# Altium schematic sheet DevKitWRM1470-r1.0.SchDoc
size A3; SheetNumber: 1; PageSetup: Record=PageOptions|CenterHorizontal=True|CenterVertical=True|PrintScale=0.52|XCorrection=1.00|YCorrection=1.00|PrintKind=1|BorderSize=5000000|LeftOffset=0|BottomOffset=0|Orientation=2|PaperLength=1000|PaperWidth=1000|Scale=100|PaperSource=7|PrintQuality=600|MediaType=1|DitherType=10|PaperKind=A4|PrintScaleMode=1
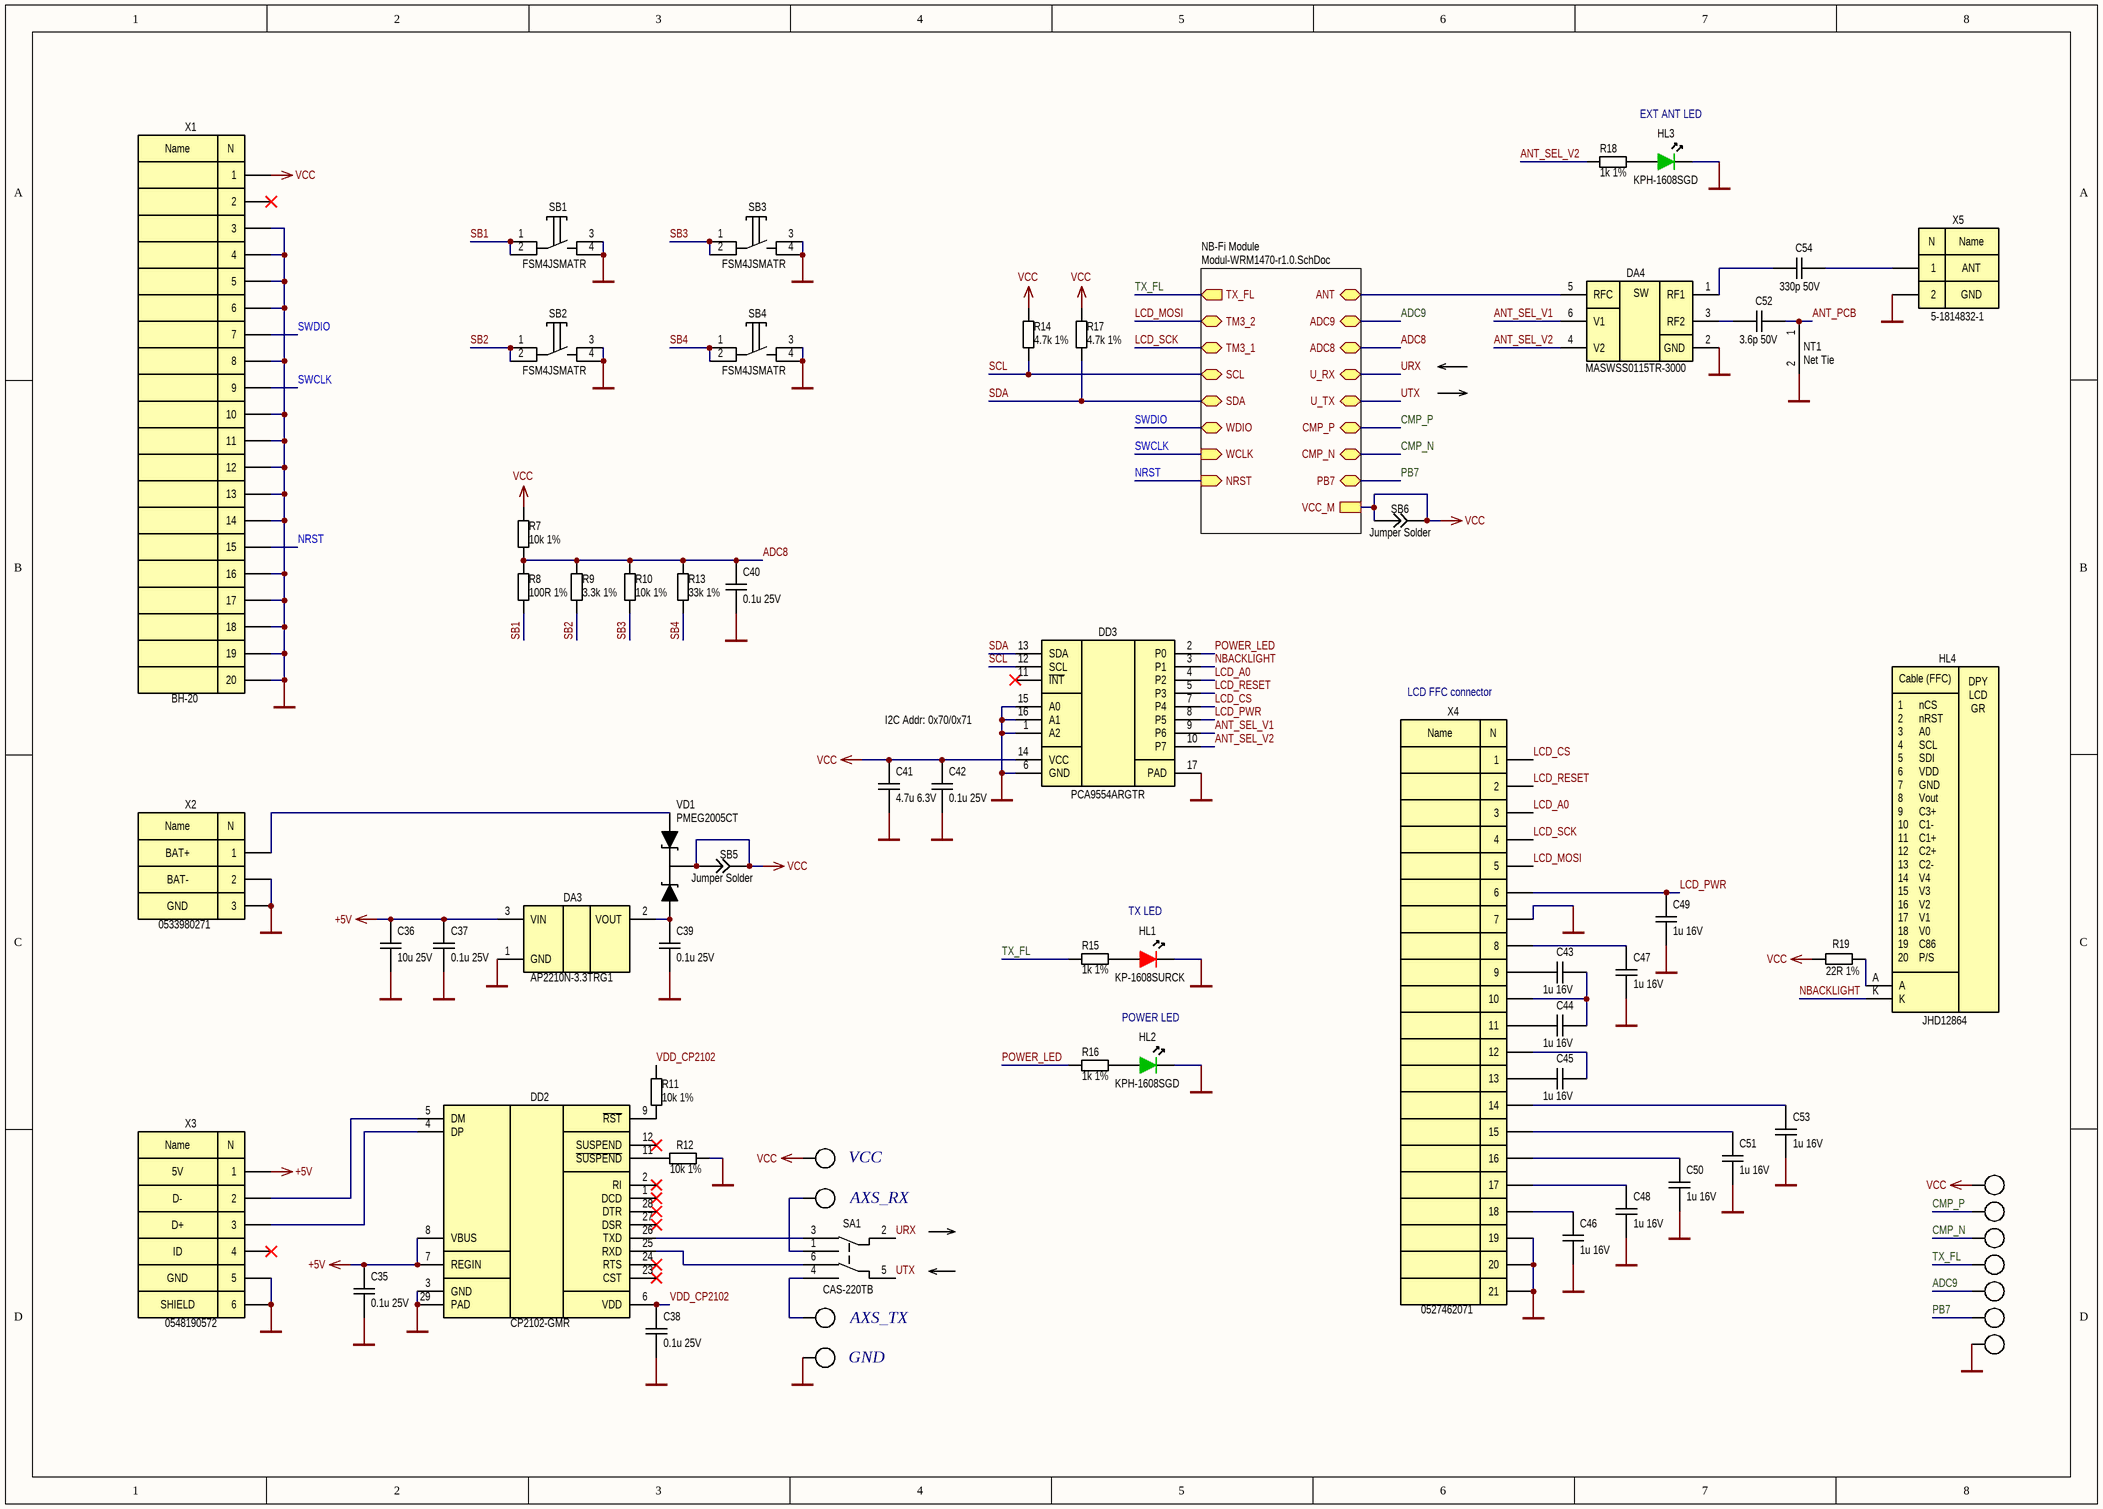
[diagram p0: DevKitWRM1470-r1.0.SchDoc]

## Parts
C35  0.1u 25V  [C0402]
C36  10u 25V  [C0805]
C37  0.1u 25V  [C0402]
C38  0.1u 25V  [C0402]
C39  0.1u 25V  [C0402]
C40  0.1u 25V  [C0402]
C41  4.7u 6.3V  [C0402]
C42  0.1u 25V  [C0402]
C43  1u 16V  [C0402]
C44  1u 16V  [C0402]
C45  1u 16V  [C0402]
C46  1u 16V  [C0402]
C47  1u 16V  [C0402]
C48  1u 16V  [C0402]
C49  1u 16V  [C0402]
C50  1u 16V  [C0402]
C51  1u 16V  [C0402]
C52  3.6p 50V  [C0402]
C53  1u 16V  [C0402]
C54  330p 50V  [C0402]
DA3  AP2210N-3.3TRG1  [SOT23-3L]
DA4  MASWSS0115TR-3000  [SOT323-6]
DD2  CP2102-GMR  [QFN28]
DD3  PCA9554ARGTR  [QFN16]
HL1  KP-1608SURCK  [LED0603_RED]
HL2  KPH-1608SGD  [LED0603_GREEN]
HL3  KPH-1608SGD  [LED0603_GREEN]
HL4  JHD12864  [JHD12864]
NT1  Net Tie  [NETTIE-5.0x4.0]  (net tie, no BOM)
R7  10k 1%  [R0402]
R8  100R 1%  [R0402]
R9  3.3k 1%  [R0402]
R10  10k 1%  [R0402]
R11  10k 1%  [R0402]
R12  10k 1%  [R0402]
R13  33k 1%  [R0402]
R14  4.7k 1%  [R0402]
R15  1k 1%  [R0402]
R16  1k 1%  [R0402]
R17  4.7k 1%  [R0402]
R18  1k 1%  [R0402]
R19  22R 1%  [R0402]
SA1  CAS-220TB  [CAS-220]
SB1  FSM4JSMATR  [FSM4JSMATR]
SB2  FSM4JSMATR  [FSM4JSMATR]
SB3  FSM4JSMATR  [FSM4JSMATR]
SB4  FSM4JSMATR  [FSM4JSMATR]
SB5  Jumper Solder  [SB0805]  (no BOM)
SB6  Jumper Solder  [SB0805]  (no BOM)
VD1  PMEG2005CT  [SOT23-3L]
X1  BH-20  [BH-20_PCB]
X2  0533980271  [0533980271_PCB]
X3  0548190572  [0548190572]
X4  0527462071  [0527462071_PCB]
X5  5-1814832-1  [5-1814832-1]
XP1  PLS-1  [HDR1X1]  (value not drawn)
XP2  PLS-1  [HDR1X1]  (value not drawn)
XP3  PLS-1  [HDR1X1]  (value not drawn)
XP4  PLS-1  [HDR1X1]  (value not drawn)
XP5  PLS-1  [HDR1X1]  (value not drawn)
XP6  PLS-1  [HDR1X1]  (value not drawn)
XP7  PLS-1  [HDR1X1]  (value not drawn)
XP8  PLS-1  [HDR1X1]  (value not drawn)
XP9  PLS-1  [HDR1X1]  (value not drawn)
XP10  PLS-1  [HDR1X1]  (value not drawn)
XP11  PLS-1  [HDR1X1]  (value not drawn)

## Sub-sheets
NB-Fi Module = Modul-WRM1470-r1.0.SchDoc: ADC8 (bidir), TM3_2 (bidir), ADC9 (bidir), TM3_1 (bidir), SCL (bidir), SDA (bidir), WDIO (bidir), WCLK (in), NRST (in), U_RX (bidir), U_TX (bidir), CMP_P (bidir), CMP_N (bidir), ANT (bidir), TX_FL (out), PB7 (bidir), VCC_M

## Nets
+5V: C35.2 C36.1 C37.2 DA3.3(VIN) DD2.7(REGIN) DD2.8(VBUS) X3.1
GND: C35.1 C36.2 C37.1 C38.1 C39.1 C40.1 C41.1 C42.1 C46.1 C47.1 C48.1 C49.1 C50.1 C51.1 C53.1 DA3.1(GND) DA4.2(GND) DD2.3(GND) DD2.29(PAD) DD3.1(A2) DD3.6(GND) DD3.15(A0) DD3.16(A1) DD3.17(PAD) HL1.2 HL2.2 HL3.2 NT1.2 R12.1 SB1.3 SB1.4 SB2.3 SB2.4 SB3.3 SB3.4 SB4.3 SB4.4 X1.3 X1.4 X1.5 X1.6 X1.8 X1.10 X1.11 X1.12 X1.13 X1.14 X1.16 X1.17 X1.18 X1.19 X1.20 X2.2 X2.3 X3.5 X3.6 X4.7 X4.19 X4.20 X4.21 X5.2 XP2.1 XP11.1
VCC: C41.2 C42.2 DD3.14(VCC) R7.2 R14.2 R17.2 R19.2 SB5.1 SB5.2 SB6.1 SB6.2 VD1.3(K) X1.1 XP3.1 XP8.1 ; sheet NB-Fi Module/VCC_M
ADC8: C40.2 R7.1 R8.2 R9.2 R10.2 R13.2 ; sheet NB-Fi Module/ADC8
ADC9: XP6.1 ; sheet NB-Fi Module/ADC9
ANT_PCB: C52.2 NT1.1
ANT_SEL_V1: DA4.6(V1) DD3.9(P6)
ANT_SEL_V2: DA4.4(V2) DD3.10(P7) R18.1
CMP_N: XP5.1 ; sheet NB-Fi Module/CMP_N
CMP_P: XP9.1 ; sheet NB-Fi Module/CMP_P
LCD_A0: DD3.4(P2) X4.3
LCD_CS: DD3.7(P4) X4.1
LCD_MOSI: X4.5 ; sheet NB-Fi Module/TM3_2
LCD_PWR: C49.2 DD3.8(P5) X4.6
LCD_RESET: DD3.5(P3) X4.2
LCD_SCK: X4.4 ; sheet NB-Fi Module/TM3_1
NBACKLIGHT: DD3.3(P1) HL4.K
NRST: X1.15 ; sheet NB-Fi Module/NRST
PB7: XP7.1 ; sheet NB-Fi Module/PB7
POWER_LED: DD3.2(P0) R16.1
SB1: R8.1 SB1.1 SB1.2
SB2: R9.1 SB2.1 SB2.2
SB3: R10.1 SB3.1 SB3.2
SB4: R13.1 SB4.1 SB4.2
SCL: DD3.12(SCL) R14.1 ; sheet NB-Fi Module/SCL
SDA: DD3.13(SDA) R17.1 ; sheet NB-Fi Module/SDA
SWCLK: X1.9 ; sheet NB-Fi Module/WCLK
SWDIO: X1.7 ; sheet NB-Fi Module/WDIO
TX_FL: R15.1 XP10.1 ; sheet NB-Fi Module/TX_FL
URX: SA1.2 ; sheet NB-Fi Module/U_RX
UTX: SA1.5 ; sheet NB-Fi Module/U_TX
VDD_CP2102: C38.2 DD2.6(VDD) R11.2
NetC39_2: C39.2 DA3.2(VOUT) VD1.2(A2)
NetC43_1: C43.1 C44.1 X4.10
NetC43_2: C43.2 X4.9
NetC44_2: C44.2 X4.11
NetC45_1: C45.1 X4.12
NetC45_2: C45.2 X4.13
NetC46_2: C46.2 X4.18
NetC47_2: C47.2 X4.8
NetC48_2: C48.2 X4.17
NetC50_2: C50.2 X4.16
NetC51_2: C51.2 X4.15
NetC52_1: C52.1 DA4.3(RF2)
NetC53_2: C53.2 X4.14
NetC54_1: C54.1 X5.1
NetC54_2: C54.2 DA4.1(RF1)
NetDA4_5: DA4.5(RFC) ; sheet NB-Fi Module/ANT
NetDD2_4: DD2.4(DP) X3.3
NetDD2_5: DD2.5(DM) X3.2
NetDD2_9: DD2.9(~{RST}) R11.1
NetDD2_11: DD2.11(~{SUSPEND}) R12.2
NetDD2_25: DD2.25(RXD) SA1.6
NetDD2_26: DD2.26(TXD) SA1.3
NetHL1_1: HL1.1 R15.2
NetHL2_1: HL2.1 R16.2
NetHL3_1: HL3.1 R18.2
NetHL4_A: HL4.A R19.1
NetSA1_1: SA1.1 XP4.1
NetSA1_4: SA1.4 XP1.1
NetVD1_1: VD1.1(A1) X2.1

Not connected (* = marked no-connect by the designer): DD2 1(DCD)* 2(RI)* 12(SUSPEND)* 23(CST)* 24(RTS)* 27(DSR)* 28(DTR)*; DD3 11(~{INT})*; X1 2*; X3 4*

## Notes on the sheet
- EXT ANT LED
- I2C Addr: 0x70/0x71
- LCD FFC connector
- BAT+
- BAT-
- GND
- TX LED
- POWER LED
- VCC
- AXS_RX
- AXS_TX
- (in symbol 5-1814832-1) N; Name; ANT; GND
- (in symbol 0527462071) Name; N
- (in symbol 0533980271) Name; N
- (in symbol 0548190572) Name; N; 5V; D-; D+; ID; GND; SHIELD
- (in symbol BH-20) Name; N
- (in symbol JHD12864) Cable (FFC); 1; nCS; DPY / LCD / GR; 2; nRST; 3; A0; 4; SCL; 5; SDI; 6; VDD; 7; GND; 8; Vout; 9; C3+; 10; C1-; 11; C1+; 12; C2+; 13; C2-; 14; V4; 15; V3; 16; V2; 17; V1; 18; V0; 19; C86; 20; P/S
- (in symbol MASWSS0115x) SW

## Library data of the parts
C35 C37-C40 C42 = CC0402KRX7R8BB104: CAP CER 0.1UF 25V X7R 0402; PartNumber: CC0402KRX7R8BB104
C36 = CL21A106KAFN3NE: CAP CER 10UF 25V X5R 0805; PartNumber: CL21A106KAFN3NE
C41 = CC0402KRX5R5BB475: CAP CER 4.7UF 6.3V X5R 0402; PartNumber: CC0402KRX5R5BB475
C43-C51 C53 = CC0402KRX5R7BB105: CAP CER 1UF 16V X5R 0402; PartNumber: CC0402KRX5R7BB105
C52 = CC0402BRNPO9BN3R6: CAP CER 3.6PF 50V NPO 0402; PartNumber: CC0402BRNPO9BN3R6
C54 = CC0402JRNPO9BN331: CAP CER 330PF 50V C0G/NPO 0402; PartNumber: CC0402JRNPO9BN331
DA3 = AP2210N-3.3TRG1: IC REG LINEAR 3.3V 300MA SOT23-3; PartNumber: AP2210N-3.3TRG1
DA4 = MASWSS0115x: RF Switch ICs DC-3.0GHz ISO 22dB IL <.3dB @ 2.4GHz; PartNumber: MASWSS0115TR-3000
DD2 = CP2102-GMR: IC USB-TO-UART BRIDGE 28VQFN; PartNumber: CP2102-GMR
DD3 = PCA9554ARGTR: IC I/O EXPANDER I2C 8B 16QFN; PartNumber: PCA9554ARGTR
HL1 = KP-1608SURCK: LED Red 0603 1.95V Forward voltage typ.; PartNumber: KP-1608SURCK
HL2 HL3 = KPH-1608SGD: Led Green 0603 2.2V Forward voltage typ.; PartNumber: KPH-1608SGD
HL4 = JHD12864: Display Graphical with LED-backlight; PartNumber: JHD12864
NT1 = NT-1: PCB Net Tie
R7 R10-R12 = RC0402FR-0710KL: RES SMD 10K OHM 1% 1/16W 0402; PartNumber: RC0402FR-0710KL
R8 = RC0402FR-07100RL: RES SMD 100 OHM 1% 1/16W 0402; PartNumber: RC0402FR-07100RL
R9 = RC0402FR-073K3L: RES SMD 3.3K OHM 1% 1/16W 0402; PartNumber: RC0402FR-073K3L
R13 = RC0402FR-0733KL: RES SMD 33K OHM 1% 1/16W 0402; PartNumber: RC0402FR-0733KL
R14 R17 = RC0402FR-074K7L: RES SMD 4.7K OHM 1% 1/16W 0402; PartNumber: RC0402FR-07470RL
R15 R16 R18 = RC0402FR-071KL: RES SMD 1K OHM 1% 1/16W 0402; PartNumber: RC0402FR-071KL
R19 = RC0402FR-0722RL: RES SMD 22 OHM 1% 1/16W 0402; PartNumber: RC0402FR-0722RL
SA1 = CAS-220TB: SWITCH SLIDE DPDT 100MA 6V; PartNumber: CAS-220TB
SB1-SB4 = FSM4JSMATR: SWITCH TACTILE SPST-NO 0.05A 24V; PartNumber: FSM4JSMATR
SB5 SB6 = JS_0805: Jumper Solder 0805; Value: *
VD1 = PMEG2005CT: DIODE ARRAY SCHOTTKY 20V SOT23; PartNumber: PMEG2005CT
X1 = BH-20: CONN MALE 20POS 2.54 (IDC-20MS); PartNumber: BH-20
X2 = 0533980271: CONN HEADER SMD 2POS 1.25MM; PartNumber: PLS-3
X3 = 0548190572: CONN RCPT USB2.0 MINI B SMD R/A; PartNumber: 0548190572
X4 = 0527462071: CONN FFC BOTTOM 20POS 0.50MM R/A; PartNumber: 0527462071
X5 = 5-1814832-1: CONN SMA JACK STR 50 OHM PCB; PartNumber: 5-1814832-1